# EAGLE design BlackIce-Nxt (EAGLE 7.5.0)
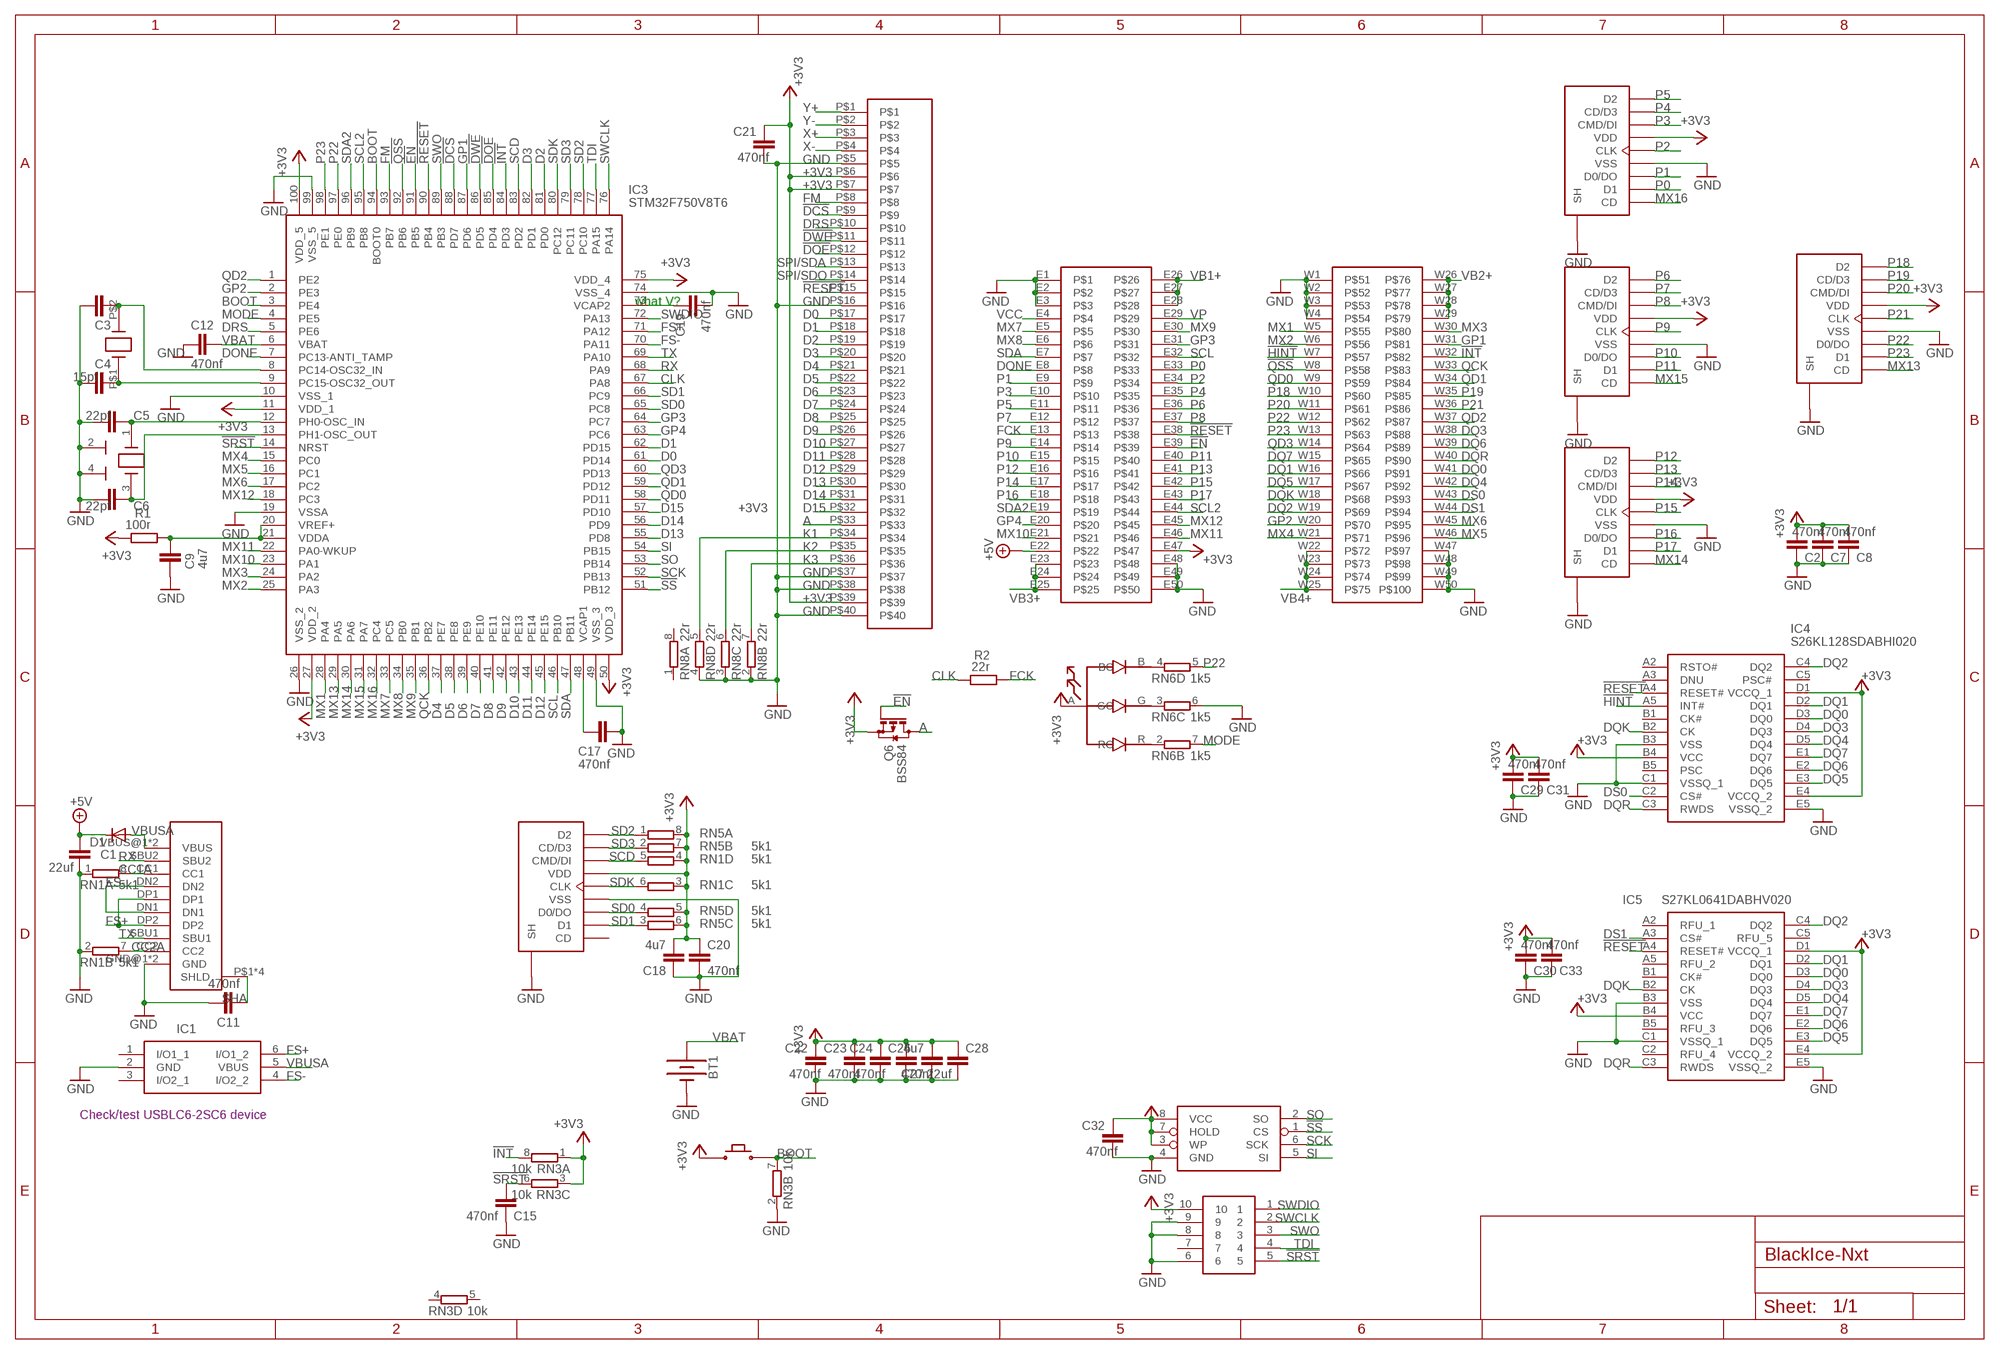
[diagram p0: schematic, sheet 1]

## Parts
B2  4X3-RA-BUTTON  [4X3-RA-BUTTON]
BT1  BATTERY-20MM_SMD  [BATTCON_20MM]
C1  22uf  C-EUC0603  [C0603]
C2  470nf  C-EUC0402  [C0402]
C3  15pf  C-EUC0402  [C0402]
C4  15pf  C-EUC0402  [C0402]
C5  22pf  C-EUC0402  [C0402]
C6  22pf  C-EUC0402  [C0402]
C7  470nf  C-EUC0402  [C0402]
C8  470nf  C-EUC0402  [C0402]
C9  4u7  C-EUC0402  [C0402]
C10  USB-C-16  [USB-C]
C11  470nf  C-EUC0402  [C0402]
C12  470nf  C-EUC0402  [C0402]
C15  470nf  C-EUC0402  [C0402]
C16  TF-15X15  [SDCARD]
C17  470nf  C-EUC0402  [C0402]
C18  4u7  C-EUC0402  [C0402]
C19  470nf  C-EUC0402  [C0402]
C20  470nf  C-EUC0402  [C0402]
C21  470nf  C-EUC0402  [C0402]
C22  470nf  C-EUC0402  [C0402]
C23  470nf  C-EUC0402  [C0402]
C24  470nf  C-EUC0402  [C0402]
C25  XF2M-4015-1AFPC-0.5  [XF2M-4015-1A]
C26  470nf  C-EUC0402  [C0402]
C27  4u7  C-EUC0402  [C0402]
C28  22uf  C-EUC0603  [C0603]
C29  470nf  C-EUC0402  [C0402]
C30  470nf  C-EUC0402  [C0402]
C31  470nf  C-EUC0402  [C0402]
C32  470nf  C-EUC0402  [C0402]
C33  470nf  C-EUC0402  [C0402]
C34  2X5-HEADER  [1.27-2X5-HEADER]
C35  TF-15X15  [SDCARD]
C36  TF-15X15  [SDCARD]
C38  TF-15X15  [SDCARD]
C41  TF-15X15  [SDCARD]
D1  DIODE-SOD123  [SOD123]
IC1  USBLC6-2SC6  [SOT95P280X145-6N]
IC3  STM32F750V8T6  [QFP50P1600X1600X160-100N]
IC4  S26KL128SDABHI020  [BGA24C100P5X5_600X800X100]
IC5  S27KL0641DABHV020  [BGA24C100P5X5_600X800X100]
IC6  AT25SDF041A  [SOIC-8-NARROW]
L1  RGB_LED  [RGB_LED_IMM]
Q6  BSS84  [SOT23]
R1  100r  R-EU_R0402  [R0402]
R2  22r  R-EU_R0402  [R0402]
RN1  5k1  4R-NEXB38V  [EXB38V]
RN3  10k  4R-NEXB38V  [EXB38V]
RN5  5k1  4R-NEXB38V  [EXB38V]
RN6  1k5  4R-NEXB38V  [EXB38V]
RN8  22r  4R-NEXB38V  [EXB38V]
T1  MEZZANINEM-TILE  [MEZZANINNE-T]
X1  FC-135  [FC135]
X2  12MZ  7M-25  [CRYSTAL-3.2X2.5]

## Nets
!DCS: C25.P$9 IC3.88(PD7)
!DOE: C25.P$12 IC3.85(PD4)
!DWE: C25.P$11 IC3.86(PD5)
!EN: IC3.91(PB5) Q6.1(G) T1.E39
!HINT: IC4.A5(INT#) T1.W7
!INT: IC3.84(PD3) RN3.8 T1.W32
!QSS: IC3.92(PB6) T1.W8
!RESET: C25.P$15 IC3.90(PB4) IC4.A4(RESET#) IC5.A4(RESET#) T1.E38
!SRST: C15.2 C34.5 IC3.14(NRST) RN3.6
!SS: IC3.51(PB12) IC6.1(CS)
+3V3: B2.P$1 C2.2 C7.2 C8.2 C16.P$6(VDD) C18.2 C20.1 C21.1 C22.1 C23.1 C24.1 C25.P$6 C25.P$7 C25.P$39 C26.2 C27.2 C28.1 C29.2 C30.2 C31.2 C32.1 C33.2 C34.10 C35.P$6(VDD) C36.P$6(VDD) C38.P$6(VDD) C41.P$6(VDD) IC3.11(VDD_1) IC3.27(VDD_2) IC3.50(VDD_3) IC3.75(VDD_4) IC3.100(VDD_5) IC4.B4(VCC) IC4.D1(VCCQ_1) IC4.E4(VCCQ_2) IC5.B4(VCC) IC5.D1(VCCQ_1) IC5.E4(VCCQ_2) IC6.3(WP) IC6.7(HOLD) IC6.8(VCC) L1.A(ANODE) Q6.2(S) R1.2 RN1.3 RN1.4 RN3.1 RN3.3 RN5.5 RN5.6 RN5.7 RN5.8 T1.E47
+5V: C1.1 D1.C T1.E22
A: C25.P$33 Q6.3(D)
BOOT: B2.P$2 IC3.3(PE4) IC3.94(BOOT0) RN3.7
CC1A: C10.CC1 RN1.8
CC2A: C10.CC2 RN1.7
CLK: IC3.67(PA8) R2.2
D0: C25.P$17 IC3.61(PD14)
D1: C25.P$18 IC3.62(PD15)
D2: C25.P$19 IC3.81(PD0)
D3: C25.P$20 IC3.82(PD1)
D4: C25.P$21 IC3.37(PE7)
D5: C25.P$22 IC3.38(PE8)
D6: C25.P$23 IC3.39(PE9)
D7: C25.P$24 IC3.40(PE10)
D8: C25.P$25 IC3.41(PE11)
D9: C25.P$26 IC3.42(PE12)
D10: C25.P$27 IC3.43(PE13)
D11: C25.P$28 IC3.44(PE14)
D12: C25.P$29 IC3.45(PE15)
D13: C25.P$30 IC3.55(PD8)
D14: C25.P$31 IC3.56(PD9)
D15: C25.P$32 IC3.57(PD10)
DONE: IC3.7(PC13-ANTI_TAMP) T1.E8
DQ0: IC4.D3(DQ0) IC5.D3(DQ0) T1.W41
DQ1: IC4.D2(DQ1) IC5.D2(DQ1) T1.W16
DQ2: IC4.C4(DQ2) IC5.C4(DQ2) T1.W19
DQ3: IC4.D4(DQ3) IC5.D4(DQ3) T1.W38
DQ4: IC4.D5(DQ4) IC5.D5(DQ4) T1.W42
DQ5: IC4.E3(DQ5) IC5.E3(DQ5) T1.W17
DQ6: IC4.E2(DQ6) IC5.E2(DQ6) T1.W39
DQ7: IC4.E1(DQ7) IC5.E1(DQ7) T1.W15
DQK: IC4.B2(CK) IC5.B2(CK) T1.W18
DQR: IC4.C3(RWDS) IC5.C3(RWDS) T1.W40
DRS: C25.P$10 IC3.5(PE6)
DS0: IC4.C2(CS#) T1.W43
DS1: IC5.A3(CS#) T1.W44
FCK: R2.1 T1.E13
FM: C25.P$8 IC3.93(PB7)
FS+: C10.DP1 C10.DP2 IC1.6(I/O1_2) IC3.71(PA12)
FS-: C10.DN1 C10.DN2 IC1.4(I/O2_2) IC3.70(PA11)
GND: BT1.2(-) C1.2 C2.1 C3.1 C4.1 C5.1 C6.1 C7.1 C8.1 C9.2 C10.GND@1(GND) C10.GND@2(GND) C11.1 C12.2 C15.1 C16.P$4(VSS) C16.P$10(SH) C16.P$11(SH) C16.P$12(SH) C16.P$13(SH) C17.1 C18.1 C19.2 C20.2 C21.2 C22.2 C23.2 C24.2 C25.P$5 C25.P$16 C25.P$37 C25.P$38 C25.P$40 C26.1 C27.1 C28.2 C29.1 C30.1 C31.1 C32.2 C33.1 C34.6 C34.8 C34.9 C35.P$4(VSS) C35.P$10(SH) C35.P$11(SH) C35.P$12(SH) C35.P$13(SH) C36.P$4(VSS) C36.P$10(SH) C36.P$11(SH) C36.P$12(SH) C36.P$13(SH) C38.P$4(VSS) C38.P$10(SH) C38.P$11(SH) C38.P$12(SH) C38.P$13(SH) C41.P$4(VSS) C41.P$10(SH) C41.P$11(SH) C41.P$12(SH) C41.P$13(SH) IC1.2(GND) IC3.10(VSS_1) IC3.19(VSSA) IC3.26(VSS_2) IC3.49(VSS_3) IC3.74(VSS_4) IC3.99(VSS_5) IC4.B3(VSS) IC4.C1(VSSQ_1) IC4.E5(VSSQ_2) IC5.B3(VSS) IC5.C1(VSSQ_1) IC5.E5(VSSQ_2) IC6.4(GND) RN1.1 RN1.2 RN3.2 RN6.6 RN8.2 RN8.3 RN8.4 T1.E1 T1.E2 T1.E3 T1.E48 T1.E49 T1.E50 T1.W1 T1.W2 T1.W3 T1.W4 T1.W47 T1.W48 T1.W49 T1.W50 X2.2(GND) X2.4(GND)
GP1: IC3.87(PD6) T1.W31
GP2: IC3.2(PE3) T1.W20
GP3: IC3.64(PC7) T1.E31
GP4: IC3.63(PC6) T1.E20
K1: C25.P$34 RN8.5
K2: C25.P$35 RN8.6
K3: C25.P$36 RN8.7
MODE: IC3.4(PE5) RN6.7
MX1: IC3.28(PA4) T1.W5
MX2: IC3.25(PA3) T1.W6
MX3: IC3.24(PA2) T1.W30
MX4: IC3.15(PC0) T1.W21
MX5: IC3.16(PC1) T1.W46
MX6: IC3.17(PC2) T1.W45
MX7: IC3.33(PC5) T1.E5
MX8: IC3.34(PB0) T1.E6
MX9: IC3.35(PB1) T1.E30
MX10: IC3.23(PA1) T1.E21
MX11: IC3.22(PA0-WKUP) T1.E46
MX12: IC3.18(PC3) T1.E45
MX13: C41.P$1(CD) IC3.29(PA5)
MX14: C36.P$1(CD) IC3.30(PA6)
MX15: C38.P$1(CD) IC3.31(PA7)
MX16: C35.P$1(CD) IC3.32(PC4)
N$2: L1.G(GC) RN6.3
N$4: L1.R(RC) RN6.2
N$6: L1.B(BC) RN6.4
N$10: C6.2 IC3.13(PH1-OSC_OUT) X2.3(X2)
N$11: C5.2 IC3.12(PH0-OSC_IN) X2.1(X1)
N$12: C4.2 IC3.9(PC15-OSC32_OUT) X1.P$1(X1)
N$13: C3.2 IC3.8(PC14-OSC32_IN) X1.P$2(X2)
N$14: C19.1 IC3.73(VCAP2)
N$87: C17.2 IC3.48(VCAP1)
N$88: C9.1 IC3.20(VREF+) IC3.21(VDDA) R1.1
P0: C35.P$2(D1) T1.E33
P1: C35.P$3(D0/DO) T1.E9
P2: C35.P$5(CLK) T1.E34
P3: C35.P$7(CMD/DI) T1.E10
P4: C35.P$8(CD/D3) T1.E35
P5: C35.P$9(D2) T1.E11
P6: C38.P$9(D2) T1.E36
P7: C38.P$8(CD/D3) T1.E12
P8: C38.P$7(CMD/DI) T1.E37
P9: C38.P$5(CLK) T1.E14
P10: C38.P$3(D0/DO) T1.E15
P11: C38.P$2(D1) T1.E40
P12: C36.P$9(D2) T1.E16
P13: C36.P$8(CD/D3) T1.E41
P14: C36.P$7(CMD/DI) T1.E17
P15: C36.P$5(CLK) T1.E42
P16: C36.P$3(D0/DO) T1.E18
P17: C36.P$2(D1) T1.E43
P18: C41.P$9(D2) T1.W10
P19: C41.P$8(CD/D3) T1.W35
P20: C41.P$7(CMD/DI) T1.W11
P21: C41.P$5(CLK) T1.W36
P22: C41.P$3(D0/DO) IC3.97(PE0) RN6.5 T1.W12
P23: C41.P$2(D1) IC3.98(PE1) T1.W13
QCK: IC3.36(PB2) T1.W33
QD0: IC3.58(PD11) T1.W9
QD1: IC3.59(PD12) T1.W34
QD2: IC3.1(PE2) T1.W37
QD3: IC3.60(PD13) T1.W14
RX: C10.SBU2 IC3.68(PA9)
SCD: C16.P$7(CMD/DI) IC3.83(PD2) RN1.5
SCK: IC3.52(PB13) IC6.6(SCK)
SCL: IC3.46(PB10) T1.E32
SCL2: IC3.95(PB8) T1.E44
SD0: C16.P$3(D0/DO) IC3.65(PC8) RN5.4
SD1: C16.P$2(D1) IC3.66(PC9) RN5.3
SD2: C16.P$9(D2) IC3.78(PC10) RN5.1
SD3: C16.P$8(CD/D3) IC3.79(PC11) RN5.2
SDA: IC3.47(PB11) T1.E7
SDA2: IC3.96(PB9) T1.E19
SDK: C16.P$5(CLK) IC3.80(PC12) RN1.6
SHA: C10.P$1(SHLD) C10.P$2(SHLD) C10.P$3(SHLD) C10.P$4(SHLD) C11.2
SI: IC3.54(PB15) IC6.5(SI)
SO: IC3.53(PB14) IC6.2(SO)
SPI/SDA: C25.P$13
SPI/SDO: C25.P$14
SWCLK: C34.2 IC3.76(PA14)
SWDIO: C34.1 IC3.72(PA13)
SWO: C34.3 IC3.89(PB3)
TDI: C34.4 IC3.77(PA15)
TX: C10.SBU1 IC3.69(PA10)
VB1+: T1.E26 T1.E27 T1.E28
VB2+: T1.W26 T1.W27 T1.W28 T1.W29
VB3+: T1.E23 T1.E24 T1.E25
VB4+: T1.W22 T1.W23 T1.W24 T1.W25
VBAT: BT1.1(+) C12.1 IC3.6(VBAT)
VBUSA: C10.VBUS@1(VBUS) C10.VBUS@2(VBUS) D1.A IC1.5(VBUS)
VCC: T1.E4
VP: T1.E29
X+: C25.P$3
X-: C25.P$4
Y+: C25.P$1
Y-: C25.P$2
Unconnected: C16.P$1(CD) C25.P$41 C25.P$42 C34.7 IC1.1(I/O1_1) IC1.3(I/O2_1) IC4.A2(RSTO#) IC4.A3(DNU) IC4.B1(CK#) IC4.B5(PSC) IC4.C5(PSC#) IC5.A2(RFU_1) IC5.A5(RFU_2) IC5.B1(CK#) IC5.B5(RFU_3) IC5.C2(RFU_4) IC5.C5(RFU_5) RN3.4 RN3.5 RN6.1 RN6.8 RN8.1 RN8.8

## Notes on the sheet
- what V?
- Check/test USBLC6-2SC6 device

## Library data of the parts
B2 = amino:4X3-RA-BUTTON
BT1 = SparkFun-Batteries:BATTERY: Battery - Single Cell A variety of battery chemistries, sizes, and footprints. Device List: 20MM_PTH - Coin Cell Battery Holder - 20mm (PTH) <https://www.sparkfun.com/products/783> 20MM_PTH_KIT- Coin Cell battery Holder - 20 mm (PTH) <http://www.sparkfun.com/products/783>kit version with special mask 6.8MM_PTH - Coin Cell Battery Holder - 6.8MM(SMD) <https://www.digikey.com/product-detail/en/seiko-instruments/MS621FE-FL11E/728-1057-ND/1889208?WT.srch=1&gclid=CNOQ5a6LzdQCFZS2wAodXCkE0g> 12MM_SMD - Coin Cell Battery Holder - 12mm (SMD) <https://www.sparkfun.com/products/10592> 12MM_PTH - Coin Cell Battery Holder - 12mm (PTH) <https://www.sparkfun.com/products/7948> 20MM_SMD - 20mm Coin Cell Battery Holder (SMD) (2 legs) Used on the Big Time Watch Kit <https://www.sparkfun.com/products/11734> 20MM_SMD_4LEGS - Coin Cell Battery Holder - 20mm (SMD) <https://www.sparkfun.com/products/11892> 20MM_SMD_4LEGS_OVERPASTE - Coin Cell Battery Holder - 20mm (SMD) <https://www.sparkfun.com/products/11892> (Over-paste on the legs) 24.5MM_PTH - Coin Cell Battery Holder - 24.5mm (PTH) <https://www.sparkfun.com/products/8863> 9V - 9V Battery Holder - PC Mount Used on the SparkFun SparkPunk Sound Kit <https://www.sparkfun.com/products/11177> and SparkFun SparkPunk Sequencer Kit <https://www.sparkfun.com/products/12707> 18650 - Battery Holder - 18650 (PTH) <https://www.sparkfun.com/products/13113> AA - Battery Holder - 1xAA (PTH) <https://www.sparkfun.com/products/7949> AAA - Battery Holder - 1xAAA (PTH) <https://www.sparkfun.com/products/12718> AA_KIT - Battery Holder - 1xAA (PTH) <https://www.sparkfun.com/products/7949> Special kit package - pads only have exposed copper on one side of the board. AAA_KIT - Battery Holder - 1xAAA (PTH) <https://www.sparkfun.com/products/12718> Special kit package - pads only have exposed copper on one side of the board.; PROD_ID: BATT-11519
C1-C9 C11 C12 C15 C17-C24 C26-C33 = rcl:C-EU: CAPACITOR, European symbol
C10 = amino:USB-C-16
C16 C35 C36 C38 C41 = amino:TF-15X15
C25 = amino:XF2M-4015-1A
C34 = amino:2X5-HEADER
D1 = diode:DIODE-: DIODE
IC1 = SamacSys_Parts:USBLC6-2SC6: TVS Diode Array Uni-Directional USBLC6-2SC6 17V, SOT-23 6-Pin Source: Datasheet <http://www.st.com/st-web-ui/static/active/en/resource/technical/document/datasheet/CD00050750.pdf>; DESCRIPTION: TVS Diode Array Uni-Directional USBLC6-2SC6 17V, SOT-23 6-Pin; HEIGHT: 1.45mm; MANUFACTURER_NAME: STMicroelectronics; MANUFACTURER_PART_NUMBER: USBLC6-2SC6; MOUSER_PART_NUMBER: 511-USBLC6-2SC6; MOUSER_PRICE-STOCK: https://www.mouser.co.uk/ProductDetail/STMicroelectronics/USBLC6-2SC6?qs=po45yt2pPpu%2FhNIlwQdTlg%3D%3D
IC3 = SamacSys_Parts:STM32F750V8T6: STMICROELECTRONICS - STM32F750V8T6 - MCU, 32BIT, 216MHZ, LQFP-100 Source: Datasheet <https://www.st.com/resource/en/datasheet/stm32f750v8.pdf>; DESCRIPTION: STMICROELECTRONICS - STM32F750V8T6 - MCU, 32BIT, 216MHZ, LQFP-100; HEIGHT: 1.6mm; MANUFACTURER_NAME: STMicroelectronics; MANUFACTURER_PART_NUMBER: STM32F750V8T6; MOUSER_PART_NUMBER: 511-STM32F750V8T6; MOUSER_PRICE-STOCK: https://www.mouser.co.uk/ProductDetail/STMicroelectronics/STM32F750V8T6?qs=%252BEew9%252B0nqrBG59alEpQKbw%3D%3D
IC4 = SamacSys_Parts:S26KL128SDABHI020: NOR Flash Nor Source: Datasheet <https://www.cypress.com/file/213346/download>; DESCRIPTION: NOR Flash Nor; HEIGHT: 1mm; MANUFACTURER_NAME: Cypress Semiconductor; MANUFACTURER_PART_NUMBER: S26KL128SDABHI020; MOUSER_PART_NUMBER: 727-S26KL128SDABHI02; MOUSER_PRICE-STOCK: https://www.mouser.co.uk/ProductDetail/Cypress-Semiconductor/S26KL128SDABHI020?qs=oeTp6q%252Bm7GMEHKDcBIxfzA%3D%3D
IC5 = SamacSys_Parts:S27KL0641DABHV020: CYPRESS SEMICONDUCTOR - S27KL0641DABHV020 - DRAM, 64MBIT, 36NS, FBGA-24 Source: Datasheet <https://www.cypress.com/file/183506/download>; DESCRIPTION: CYPRESS SEMICONDUCTOR - S27KL0641DABHV020 - DRAM, 64MBIT, 36NS, FBGA-24; HEIGHT: 1mm; MANUFACTURER_NAME: Cypress Semiconductor; MANUFACTURER_PART_NUMBER: S27KL0641DABHV020; MOUSER_PART_NUMBER: 727-S27KL0641DABHV02; MOUSER_PRICE-STOCK: https://www.mouser.co.uk/ProductDetail/Cypress-Semiconductor/S27KL0641DABHV020?qs=74EMXstkWMU1y2SuN5BsMA%3D%3D
IC6 = amino:AT25SDF041A
L1 = amino:RGB_LED
Q6 = transistor-small-signal:BSS84: P-CHANNEL MOS FET
R1 R2 = resistor:R-EU_: RESISTOR, European symbol
RN1 RN3 RN5 RN6 RN8 = resistor-dil:4R-N: Array Chip Resistor Source: RS Component / Phycomp; OC_FARNELL: unknown; OC_NEWARK: unknown
T1 = amino:MEZZANINE
X1 = amino:FC-135
X2 = amino:7M-25

## Board
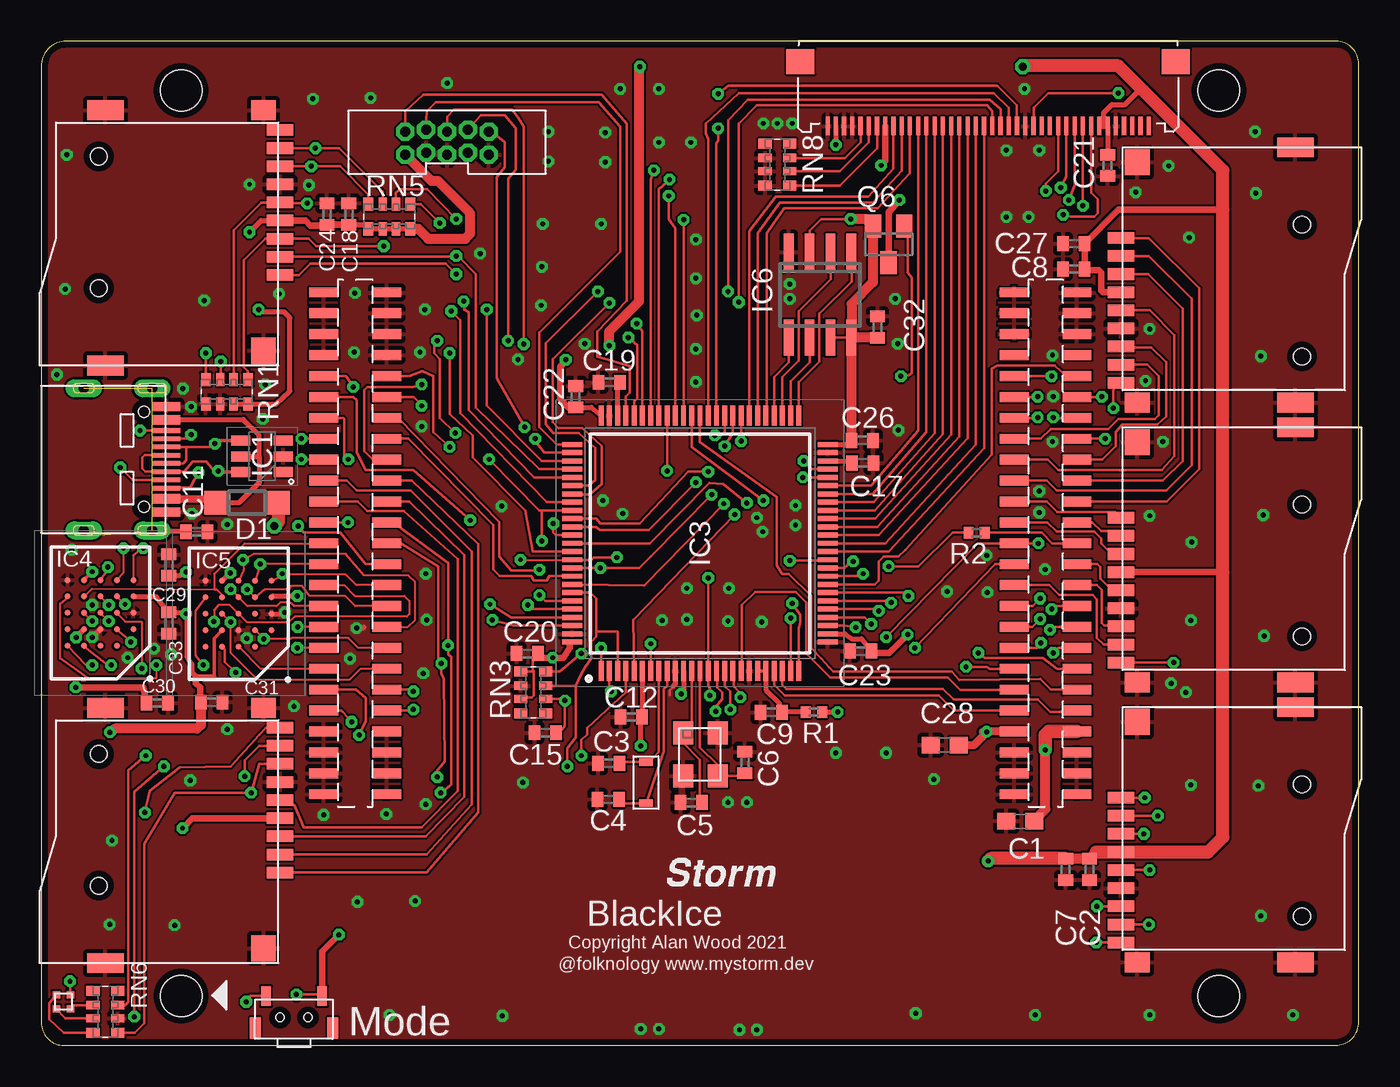
[diagram p1: board, top side]
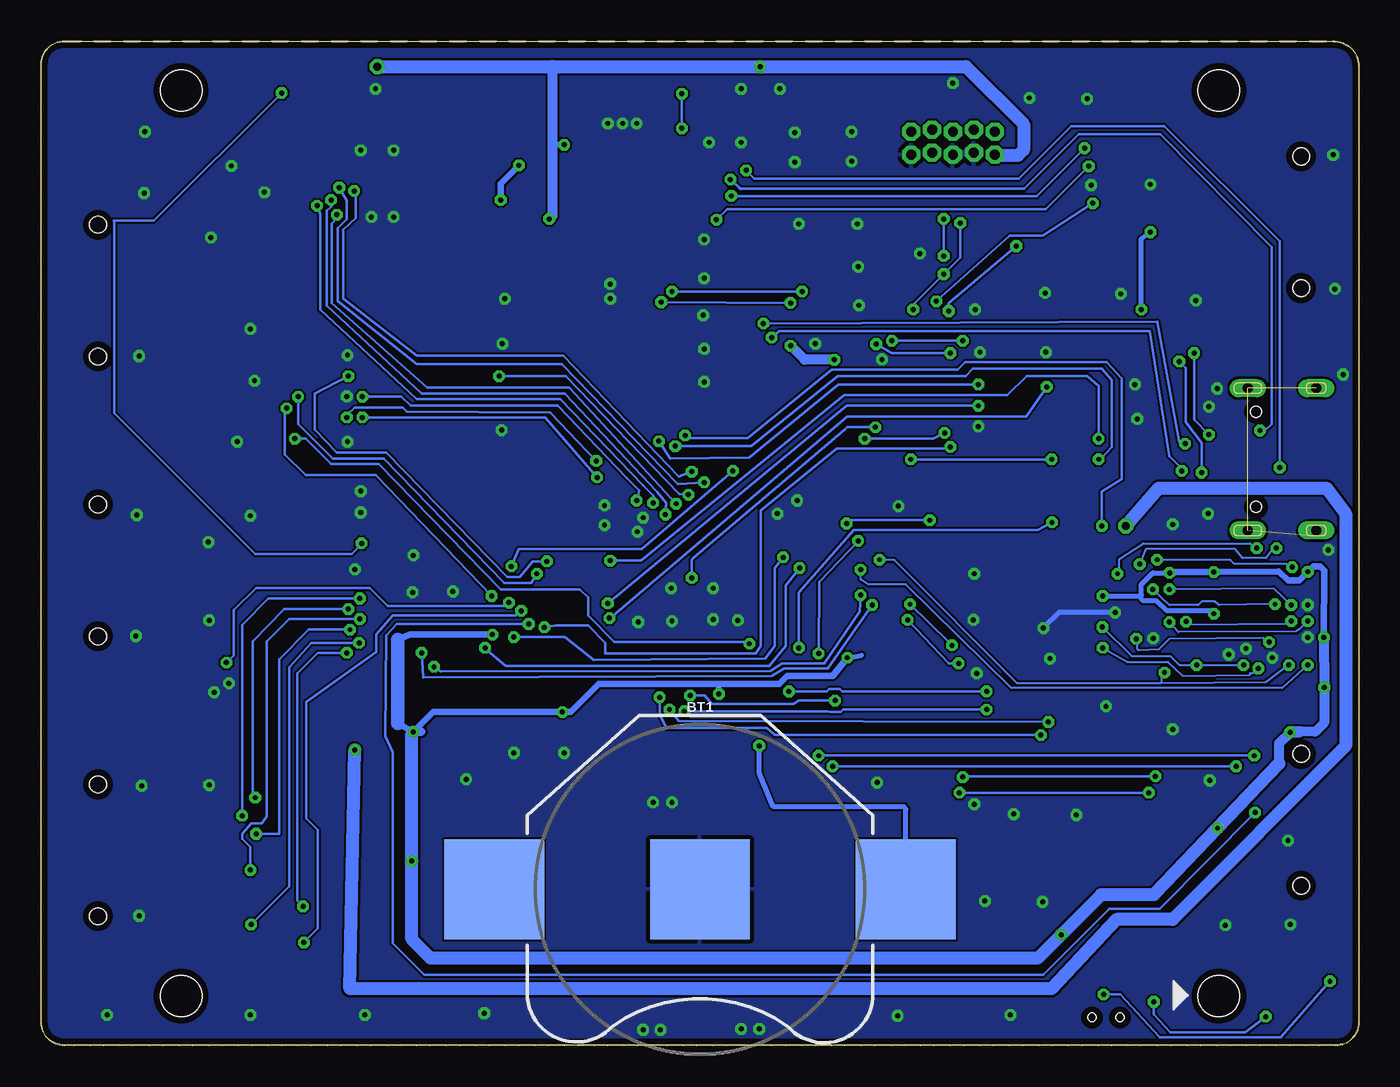
[diagram p2: board, bottom side, seen from below]

Size 80 x 61 mm. Coordinates in mm from the lower left corner, seen from the top.
Outline: 78.62,61 1.52,61 arc90 0,59.48 0,1.38 arc90 1.38,0 78.59,0 arc90 80,1.41 80,59.62 arc90 78.62,61
Copper layers (1*16): Top 0.035mm / dielectric 1.5mm / Bottom 0.035mm
Design rules "JLC-2-layer *": minimum track width 5mil, minimum drill 0.3mm, track to track 5mil, track to pad 5mil, pad to pad 5mil, via to via 6mil, smd to smd 5mil, copper to edge 0.4mm, drill to drill 0.5mm, minimum pad ring 10mil, minimum via ring 8mil, stop-mask expansion 4mil, vias tented up to drill 0.3mm, thermal gap 10mil

### Footprints (pad centres in the part's own frame; a part is rotated, then mirrored left to right if it is on the bottom)
4X3-RA-BUTTON = smd 0.6 x 1.2: P$1 -1.7,-2.6; P$2 1.7,-2.6 | smd 0.65 x 1.3: SH1 -2.35,-0.65; SH2 2.35,-0.65 | hole 0.5: -0.85,-1.3; 0.85,-1.3
BATTCON_20MM = smd 6.07 x 6.07: 1 -12.5,0; 2 0,0; 3 12.5,0
C0603 = smd 1.1 x 1: 1 -0.85,0; 2 0.85,0
C0402 = smd 0.7 x 0.9: 1 -0.65,0; 2 0.65,0
USB-C = smd 0.28 x 1.7: CC1 -1.25,5; CC2 1.75,5; DN1 0.25,5; DN2 -0.75,5; DP1 -0.25,5; DP2 0.75,5; SBU1 1.25,5; SBU2 -1.75,5 | smd 0.56 x 1.7: GND@1 -3.2,5; GND@2 3.2,5; VBUS@1 -2.4,5; VBUS@2 2.4,5 | drill 0.6 long: P$1 -4.32,4.15; P$2 4.32,4.15; P$3 -4.32,0; P$4 4.32,0 | hole 0.65: -2.89,3.65; 2.89,3.65
SDCARD = smd 0.7 x 1.6: P$1 -5.5,1.1; P$2 -4.4,1.1; P$3 -3.3,1.1; P$4 -2.2,1.1; P$5 -1.1,1.1; P$6 0,1.1; P$7 1.1,1.1; P$8 2.2,1.1; P$9 3.3,1.1 | smd 1.2 x 1.5: P$10 -6.7,0.1 | smd 1.6 x 1.5: P$11 7.9,0.1 | smd 1.2 x 2.2: P$12 -6.7,-9.5; P$13 8.8,-9.5 | hole 1: -3.9,-9.9; 4.1,-9.9
XF2M-4015-1A = smd 0.25 x 1.1: P$1 -9.75,0.9; P$2 -9.25,0.9; P$3 -8.75,0.9; P$4 -8.25,0.9; P$5 -7.75,0.9; P$6 -7.25,0.9; P$7 -6.75,0.9; P$8 -6.25,0.9; P$9 -5.75,0.9; P$10 -5.25,0.9; P$11 -4.75,0.9; P$12 -4.25,0.9; P$13 -3.75,0.9; P$14 -3.25,0.9; P$15 -2.75,0.9; P$16 -2.25,0.9; P$17 -1.75,0.9; P$18 -1.25,0.9; P$19 -0.75,0.9; P$20 -0.25,0.9; P$21 0.25,0.9; P$22 0.75,0.9; P$23 1.25,0.9; P$24 1.75,0.9; P$25 2.25,0.9; P$26 2.75,0.9; P$27 3.25,0.9; P$28 3.75,0.9; P$29 4.25,0.9; P$30 4.75,0.9; P$31 5.25,0.9; P$32 5.75,0.9; P$33 6.25,0.9; P$34 6.75,0.9; P$35 7.25,0.9; P$36 7.75,0.9; P$37 8.25,0.9; P$38 8.75,0.9; P$39 9.25,0.9; P$40 9.75,0.9 | smd 1.7 x 1.5: P$41 11.4,-3; P$42 -11.4,-3
1.27-2X5-HEADER = drill 0.6 pad 1.016 octagon: 1 -2.54,0; 2 -1.27,-0.127; 3 0,0; 4 1.27,-0.127; 5 2.54,0; 6 2.54,1.397; 7 1.27,1.27; 8 0,1.397; 9 -1.27,1.27; 10 -2.54,1.397
SOD123 = smd 1.4 x 1.4: A 1.9,0; C -1.9,0
SOT95P280X145-6N = smd 1.15 x 0.6: 1 -1.3,0.95; 2 -1.3,0; 3 -1.3,-0.95; 4 1.3,-0.95; 5 1.3,0; 6 1.3,0.95
QFP50P1600X1600X160-100N = smd 1.2 x 0.3: 1 -7.75,6; 2 -7.75,5.5; 3 -7.75,5; 4 -7.75,4.5; 5 -7.75,4; 6 -7.75,3.5; 7 -7.75,3; 8 -7.75,2.5; 9 -7.75,2; 10 -7.75,1.5; 11 -7.75,1; 12 -7.75,0.5; 13 -7.75,0; 14 -7.75,-0.5; 15 -7.75,-1; 16 -7.75,-1.5; 17 -7.75,-2; 18 -7.75,-2.5; 19 -7.75,-3; 20 -7.75,-3.5; 21 -7.75,-4; 22 -7.75,-4.5; 23 -7.75,-5; 24 -7.75,-5.5; 25 -7.75,-6; 51 7.75,-6; 52 7.75,-5.5; 53 7.75,-5; 54 7.75,-4.5; 55 7.75,-4; 56 7.75,-3.5; 57 7.75,-3; 58 7.75,-2.5; 59 7.75,-2; 60 7.75,-1.5; 61 7.75,-1; 62 7.75,-0.5; 63 7.75,0; 64 7.75,0.5; 65 7.75,1; 66 7.75,1.5; 67 7.75,2; 68 7.75,2.5; 69 7.75,3; 70 7.75,3.5; 71 7.75,4; 72 7.75,4.5; 73 7.75,5; 74 7.75,5.5; 75 7.75,6 | smd 0.3 x 1.2: 26 -6,-7.75; 27 -5.5,-7.75; 28 -5,-7.75; 29 -4.5,-7.75; 30 -4,-7.75; 31 -3.5,-7.75; 32 -3,-7.75; 33 -2.5,-7.75; 34 -2,-7.75; 35 -1.5,-7.75; 36 -1,-7.75; 37 -0.5,-7.75; 38 0,-7.75; 39 0.5,-7.75; 40 1,-7.75; 41 1.5,-7.75; 42 2,-7.75; 43 2.5,-7.75; 44 3,-7.75; 45 3.5,-7.75; 46 4,-7.75; 47 4.5,-7.75; 48 5,-7.75; 49 5.5,-7.75; 50 6,-7.75; 76 6,7.75; 77 5.5,7.75; 78 5,7.75; 79 4.5,7.75; 80 4,7.75; 81 3.5,7.75; 82 3,7.75; 83 2.5,7.75; 84 2,7.75; 85 1.5,7.75; 86 1,7.75; 87 0.5,7.75; 88 0,7.75; 89 -0.5,7.75; 90 -1,7.75; 91 -1.5,7.75; 92 -2,7.75; 93 -2.5,7.75; 94 -3,7.75; 95 -3.5,7.75; 96 -4,7.75; 97 -4.5,7.75; 98 -5,7.75; 99 -5.5,7.75; 100 -6,7.75
BGA24C100P5X5_600X800X100 = smd 0.37 x 0.37: A2 -1,2; A3 0,2; A4 1,2; A5 2,2; B1 -2,1; B2 -1,1; B3 0,1; B4 1,1; B5 2,1; C1 -2,0; C2 -1,0; C3 0,0; C4 1,0; C5 2,0; D1 -2,-1; D2 -1,-1; D3 0,-1; D4 1,-1; D5 2,-1; E1 -2,-2; E2 -1,-2; E3 0,-2; E4 1,-2; E5 2,-2
SOIC-8-NARROW = smd 0.6 x 2.2: 1 -1.905,-2.6; 2 -0.635,-2.6; 3 0.635,-2.6; 4 1.905,-2.6; 5 1.905,2.6; 6 0.635,2.6; 7 -0.635,2.6; 8 -1.905,2.6
RGB_LED_IMM = smd 0.45 x 0.45: A 0.425,0.425; B -0.425,0.425; G -0.425,-0.425; R 0.425,-0.425
SOT23 = smd 1 x 1.4: 1 -0.95,-1.1; 2 0.95,-1.1; 3 0,1.1
R0402 = smd 0.6 x 0.7: 1 -0.5,0; 2 0.5,0
EXB38V = smd 0.6 x 0.8: 1 -1.275,-0.75; 4 1.275,-0.75; 5 1.275,0.75; 8 -1.275,0.75 | smd 0.5 x 0.8: 2 -0.4,-0.75; 3 0.4,-0.75; 6 0.4,0.75; 7 -0.4,0.75
MEZZANINNE-T = smd 1.75 x 0.6 bottom: E1 -22.885,15.24; E2 -22.885,13.97; E3 -22.885,12.7; E4 -22.885,11.43; E5 -22.885,10.16; E6 -22.885,8.89; E7 -22.885,7.62; E8 -22.885,6.35; E9 -22.885,5.08; E10 -22.885,3.81; E11 -22.885,2.54; E12 -22.885,1.27; E13 -22.885,0; E14 -22.885,-1.27; E15 -22.885,-2.54; E16 -22.885,-3.81; E17 -22.885,-5.08; E18 -22.885,-6.35; E19 -22.885,-7.62; E20 -22.885,-8.89; E21 -22.885,-10.16; E22 -22.885,-11.43; E23 -22.885,-12.7; E24 -22.885,-13.97; E25 -22.885,-15.24; E26 -19.075,15.24; E27 -19.075,13.97; E28 -19.075,12.7; E29 -19.075,11.43; E30 -19.075,10.16; E31 -19.075,8.89; E32 -19.075,7.62; E33 -19.075,6.35; E34 -19.075,5.08; E35 -19.075,3.81; E36 -19.075,2.54; E37 -19.075,1.27; E38 -19.075,0; E39 -19.075,-1.27; E40 -19.075,-2.54; E41 -19.075,-3.81; E42 -19.075,-5.08; E43 -19.075,-6.35; E44 -19.075,-7.62; E45 -19.075,-8.89; E46 -19.075,-10.16; E47 -19.075,-11.43; E48 -19.075,-12.7; E49 -19.075,-13.97; E50 -19.075,-15.24; W1 19.025,15.24; W2 19.025,13.97; W3 19.025,12.7; W4 19.025,11.43; W5 19.025,10.16; W6 19.025,8.89; W7 19.025,7.62; W8 19.025,6.35; W9 19.025,5.08; W10 19.025,3.81; W11 19.025,2.54; W12 19.025,1.27; W13 19.025,0; W14 19.025,-1.27; W15 19.025,-2.54; W16 19.025,-3.81; W17 19.025,-5.08; W18 19.025,-6.35; W19 19.025,-7.62; W20 19.025,-8.89; W21 19.025,-10.16; W22 19.025,-11.43; W23 19.025,-12.7; W24 19.025,-13.97; W25 19.025,-15.24; W26 22.835,15.24; W27 22.835,13.97; W28 22.835,12.7; W29 22.835,11.43; W30 22.835,10.16; W31 22.835,8.89; W32 22.835,7.62; W33 22.835,6.35; W34 22.835,5.08; W35 22.835,3.81; W36 22.835,2.54; W37 22.835,1.27; W38 22.835,0; W39 22.835,-1.27; W40 22.835,-2.54; W41 22.835,-3.81; W42 22.835,-5.08; W43 22.835,-6.35; W44 22.835,-7.62; W45 22.835,-8.89; W46 22.835,-10.16; W47 22.835,-11.43; W48 22.835,-12.7; W49 22.835,-13.97; W50 22.835,-15.24 | hole 2.5: -31.5,-27.5; 31.5,-27.5; -31.5,27.5; 31.5,27.5
FC135 = smd 0.45 x 0.8: P$1 -1.25,0; P$2 1.25,0
CRYSTAL-3.2X2.5 = smd 1.4 x 1.2: 1 -1.3,-1; 2 1.3,-1; 3 1.3,1.1; 4 -1.3,1.1

### Placement (x,y rotation side)
B2  15.35,0.4 180 top
BT1  40,9.48 180 bottom
C1  59.44,13.62 180 top
C2  63.65,10.7 90 top
C3  34.47,17.13 0 top
C4  34.42,14.95 0 top
C5  39.48,14.76 0 top
C6  42.73,17.18 270 top
C7  62.2,10.7 90 top
C8  62.7,47.15 0 top
C9  44.34,20.23 180 top
C10  2.59,35.6 270 top
C11  9.45,31.2 180 top
C12  35.83,19.95 180 top
C15  30.61,18.99 0 top
C16  13.4,50.1 270 top
C17  49.88,35.38 180 top
C18  18.68,50.5 270 top
C19  34.48,40.27 180 top
C20  29.52,23.8 180 top
C21  64.75,53.45 270 top
C22  32.45,39.4 90 top
C23  49.75,23.95 180 top
C24  17.35,50.5 90 top
C25  57.5,56.75 180 top
C26  49.85,36.75 180 top
C27  62.7,48.7 0 top
C28  54.85,18.25 180 top
C29  7.75,29.18 270 top
C30  7.05,20.8 180 top
C31  10.35,20.85 180 top
C32  50.78,43.64 90 top
C33  7.75,25.65 90 top
C34  24.64,55.5 180 bottom
C35  66.65,45.75 90 top
C36  66.65,11.75 90 top
C38  66.65,28.75 90 top
C41  13.4,13.8 270 top
D1  12.5,32.96 180 top
IC1  13.41,35.78 180 top
IC3  40,30.5 90 top
IC4  3.6,26.27 180 top
IC5  11.99,26.22 180 top
IC6  47.28,45.6 180 top
L1  1.35,2.65 0 top
Q6  51.45,48.65 180 top
R1  46.91,20.26 0 top
R2  56.8,31.15 180 top
RN1  11.28,39.7 0 top
RN3  29.88,21.45 270 top
RN5  21.14,50.35 180 top
RN6  3.9,2.05 270 top
RN8  44.7,53.5 270 top
T1  40,30.5 0 bottom
X1  36.73,15.97 90 top
X2  39.98,17.68 270 top

### Tracks (layer width: path | path; a pad name or v marks a point on that pad's centre or on a via)
!DCS  (via drill 0.3)
  Top 0.15: IC3.88 36.95,30.5 40.55,34.15 41.4,34.1 v42.85,32.95 | v63.25,51 63.25,55.75 C25.P$9
  Bottom 0.15: v42.85,32.95 42.85,33.4 43.45,34 48.5,39.25 57.2,39.25 63.05,44.7 63.05,50.5 v63.25,51
!DOE  (via drill 0.3)
  Top 0.15: IC3.85 33.7,32 33.95,31.7 36.35,31.7 39.3,34.85 v40.5,34.85 | v61,51.9 61,52.35 61.75,53.1 C25.P$12
  Bottom 0.15: v40.5,34.85 41.3,34.55 48.3,41.9 57.2,41.9 61.65,45.35 61.65,49.55 60.9,50.25 60.9,51.6 v61,51.9
!DWE  (via drill 0.3)
  Top 0.15: IC3.86 33.7,31.5 33.9,31.3 36.9,31.3 v39.75,34.2 | v61.9,52.1 62.25,52.8 C25.P$11
  Bottom 0.15: v39.75,34.2 41.35,34.1 48.4,41.4 57.2,41.4 62,45.2 62,49.65 61.45,50.2 61.45,51.3 v61.9,52.1
!EN  (via drill 0.3)
  Top 0.15: T1.E39 57.93,29.23 v53.05,24.15 | IC3.91 v33.95,29 36.3,29 37,29.7 v40.7,33.45 | v52.2,40.65 52.65,40.7 52.85,40.85 52.85,46.65 52.6,46.95 52.6,49.55 Q6.1
  Bottom 0.15: v53.05,24.15 53.1,24.15 51.8,23.05 35.8,23.05 34.8,24.25 34.8,27.95 v33.95,29 | v40.7,33.45 41.25,33.5 48.15,40.65 v52.2,40.65
!HINT  (via drill 0.3)
  Top 0.127: IC4.A5 2.72,23.1 v3.1,23.1
  Top 0.15: T1.W7 21.68,38.12 27.8,31.8 27.8,29.7 28.55,28.85 30.2,28.85 v30.25,28.9
  Bottom 0.127: v3.1,23.1 4.65,21.7 21.1,21.7 27.5,28 29.8,28 30.25,28.3 v30.25,28.9
!INT  (via drill 0.3)
  Top 0.15: T1.W32 18.33,38.12 18.4,38.05 18.4,35.8 v18.65,35.6 | v27.2,35.6 30.25,32.5 30.4,32.5 | 30.4,32.5 IC3.84 | RN3.8 31.47,22.72 v32.8,23.8 | v30.4,30.65 30.4,32.5
  Bottom 0.15: v18.65,35.6 v27.2,35.6 | v32.8,23.8 32.75,28.15 v30.4,30.65
!QSS
  Top 0.15: T1.W8 22.3,36.85 27.45,31.6 27.45,28.9 27.85,28.5 29.75,28.5 29.9,28.25 30.7,28.25 30.85,28.5 IC3.92
!RESET  (via drill 0.3)
  Top 0.127: IC4.A4 4.05,23.12 v4.25,23.1 | v29.1,29.5 IC3.90
  Top 0.15: v51.3,24.8 56.85,30.5 T1.E38 v60.55,30.5 | v34.95,29.65 33.55,29.65 33.4,29.5 IC3.90 | 60.25,55.75 C25.P$15 60.25,55.75 60.25,56.95 61.15,57.85 v65.4,57.85 | IC5.A4 11.15,24.06 11.15,23.3 v11.8,22.65
  Bottom 0.127: v4.25,23.1 5.65,22.05 12,22 | 12,22 20.75,22 28.2,29.5 v29.1,29.5 | 12,22.4 12,22
  Bottom 0.15: v51.3,24.8 48.2,24.8 46.45,23.4 36.05,23.5 35.45,24.25 35.45,29 v34.95,29.65 | v60.55,30.5 61.15,29.85 67,29.85 75.55,38.4 75.55,50.05 75.6,50.1 73.15,50.1 v65.4,57.85 | v11.8,22.65 12,22.4
!SRST  (via drill 0.3)
  Top 0.15: v40.6,21.25 40.6,21.7 40.5,21.85 IC3.14 v40.5,28.4 | RN3.6 31.6,21.05 v31.8,20.95 31.8,19.4 31.65,19.2 C15.2 | C34.5 27.35,55.5 28.15,54.85 28.15,53.35 27.65,52.75 27.65,40.55 v29.35,37.55
  Bottom 0.15: v40.6,21.25 40.35,21.2 40.3,21.25 39.7,21.25 39.3,20.75 34.3,20.75 34,20.95 v31.8,20.95 | v29.35,37.55 31.05,37.55 31.2,37.4 40.4,29.6 40.5,29.5 v40.5,28.4
!SS
  Top 0.15: IC3.51 46,40.3 47.25,41.55 47.25,44.45 49.2,46.4 IC6.1
+3V3  (via drill 0.3, 0.5)
  Top 0.15: RN3.1 29.83,22.72 | 29.83,22.72 29.9,22.75 29.9,21.25 29.8,21.15 29.13,21.15 RN3.3 | 29.83,22.72 29.85,22.74 29.85,23.48 C20.1 | IC6.7 IC6.8 | IC6.3 46.65,49.5 47.35,50.2 v49.15,50.2 | L1.A 1.78,3.77 v1.75,3.9 | v15.5,3.1 16.85,3.1 B2.P$1
  Top 0.2: IC5.B4 10.5,24.73 10.5,22.4 | IC4.E4 v3.1,28.77 | IC4.D1 5.62,27.25
  Top 0.3: R1.2 48.05,20.26 v48.35,20.25 | C22.1 33.4,38.75 IC3.75 | C25.P$7 C25.P$6 | IC3.50 49,36.5 C26.2 | IC3.27 48.8,25 49.2,24.7 49.8,24.7 C23.1 50.4,23.85 | IC5.E4 10.99,28.24 v11.49,28.7 | C29.2 8.45,28.55 8.65,28.75 v8.8,28.75 | C33.2 7,27.25 5.62,27.25
  Top 0.305: 10.5,22.4 9.4,22.4 9.15,22.65 9.15,23.15 8.85,23.6 8.85,25.92 v8.8,26.22 8.62,26.3 C33.2 | IC5.D1 14.07,27.3 v15.55,27.3 | 32.1,24.35 IC3.100 | 3.15,28.82 v3.1,28.77 | IC4.B4 2.13,24.8 v2.12,24.78 | IC3.11 39,21.5 v38.85,21.35 | C18.2 19.61,49.85 RN5.5 RN5.6 RN5.7 RN5.8 | C25.P$39 v48.24,54.7 v48.25,54.7 | 66.9,58 66.65,58 65.8,57.15 65,57.15 64.5,56.65 64.5,56.09 C25.P$6 C21.1 | v13.2,44.7 13.2,44.55 14.75,44.55 15.1,44.2 15.1,39.75 14.25,38.95 RN1.4 RN1.3 | v12.65,49.4 13.35,50.1 C16.P$6
  Top 0.406: C20.1 30.42,23.55 v31.05,23.55 31.7,23.55 32.1,24.15 32.1,24.35 | 50.4,23.85 51.5,23.85 v52.6,24.95 | v31.85,41.65 31.5,41.2 31.5,39.25 32,38.75 C22.1 | C35.P$6 64.45,45.75 64.35,45.85 64.35,46.95 64.2,47.1 63.4,47.1 C8.2 C27.2 65.4,50.75 71.75,50.75 | C30.2 6.2,21.75 v2.1,21.75 | 9.4,22.4 9.4,22 9.65,21.75 9.65,20.85 | C41.P$6 9.18,13.8 v8.58,13.2 | B2.P$1 17.05,5.7 v18.07,6.73 | C16.P$6 16.05,50.1 16.35,49.8 17.3,49.8 C24.1 C18.2 | C38.P$6 71.75,28.75
  Top 0.5: T1.E47 57.17,19.07 v57.4,19.05 57.45,19.05 56.65,18.25 C28.1
  Top 0.61: C32.1 IC6.8 | C26.2 IC6.8 | IC6.8 49.2,45.05 50.5,46.35 Q6.2 50.05,50.2 v49.15,50.2 | C7.2 C2.2 64.05,11.75 | C31.2 9.7,19.45 9.45,19.25 4.5,19.25 v4.18,19.02 | RN5.8 22.9,49.6 23.5,49 25.75,49 26.05,49.3 26.05,50.55 24.1,52.5 23.7,52.5 C34.10 | v34.5,42.5 34.5,43.4 36.3,45.2 36.3,59.4 v36.35,59.45
  Top 0.8: C7.2 57.65,11.35 v57.5,11.2 | v59.6,59.45 59.65,59.5 65.4,59.5 66.9,58 71.75,53.15 71.75,50.75 71.75,28.75 71.75,12.65 70.85,11.75 C36.P$6 64.05,11.75
  Bottom 0.15: v1.75,3.9 4.75,0.5 12.1,0.5 14.5,3.1 v15.5,3.1
  Bottom 0.3: v48.35,20.25 48.45,20.25 | v31.05,23.55 30.2,23.7
  Bottom 0.305: v8.8,26.22 8.68,26.4 11.65,26.4 12.3,27 13.1,27 13.2,27.1 13.2,27.35 | 13.2,27.35 13.2,28 12.5,28.7 v11.49,28.7 | v15.55,27.3 13.25,27.3 13.2,27.35 | v38.85,21.35 38.85,21.96 | v48.25,54.7 48.9,54.7 48.95,54.65 | v13.2,44.7 13.2,49 v12.65,49.4
  Bottom 0.406: v52.6,24.95 57.6,24.95 58.35,24.65 | 58.35,19.55 v57.4,19.05 56.2,20.25 48.45,20.25 47.85,20.25 46.15,21.96 38.85,21.96 35.2,21.96 34.7,22.45 31.95,22.45 v31.05,23.55 | v11.49,28.7 11.34,28.75 v8.8,28.75 4.85,28.8 4.3,28.25 3.62,28.25 v3.1,28.77 2.77,29.1 2.35,29.1 2.1,28.85 v2.12,24.78 | v8.58,13.2 8.58,13.17 9.12,12.63
  Bottom 0.5: v57.4,19.05 56.9,19.05
  Bottom 0.61: v2.12,24.78 v2.1,21.75 2.1,19.6 2.65,19.05 3.5,19.08 | 3.5,19.08 4.1,19.1 v4.18,19.02 | v4.18,19.02 4.85,18.35 4.85,17.1 | 57.5,18.95 v57.4,19.05 | v4.18,19.02 3.56,19.02 3.5,19.08 | v31.85,41.65 33.65,41.65 v34.5,42.5 | v49.15,50.2 48.95,50.4 48.95,54.65 48.95,59.45
  Bottom 0.8: 4.85,17.1 v8.58,13.2 12.45,9.15 15.65,9.15 v18.07,6.73 19.5,5.3 56.35,5.3 57.5,6.45 v57.5,11.2 57.5,18.95 | v59.6,59.45 48.95,59.45 v36.35,59.45 23.85,59.45 20.35,55.95 20.35,54.4 20.7,54.05 22.05,54.05 C34.10
  Bottom 0.813: 58.35,24.65 58.35,19.55
+5V  (via drill 0.3, 0.5)
  Top 0.61: C1.1 60.3,13.68 60.96,14.35 60.96,17.94 v60.95,17.95
  Top 0.8: D1.C 14.4,31.8 v14.15,31.55
  Top 0.813: T1.E22 61.17,19.07 60.95,18.85 v60.95,17.95
  Bottom 0.8: v60.95,17.95 61.25,3.45 18.65,3.45 14.7,7.65 11.3,7.65 0.8,18.2 0.8,32.3 1.95,33.85 12.15,33.85 v14.15,31.55
A  (via drill 0.3)
  Top 0.406: Q6.3 51.45,50.6 v52.1,51.35 | v51,53.45 51.24,53.69 C25.P$33
  Bottom 0.406: v52.1,51.35 52.1,52.35 v51,53.45
BOOT  (via drill 0.3)
  Top 0.15: v5.65,1.75 5.65,15.4 v7.45,16.95 | v31.95,16.95 31.95,18.05 32.45,18.7 32.45,21.84 | IC3.94 33.35,27.5 33.7,27.15 33.7,25.1 | 33.7,25.1 33.7,24.85 33.4,24.5 33.4,23.5 33.02,22.98 32.75,22.5 32.45,21.84 | RN3.7 32.45,21.84 | IC3.3 35,25.1 34.95,25.15 33.75,25.15 33.7,25.1 | B2.P$2 12.7,3 v12.45,2.65
  Bottom 0.15: v7.45,16.95 v31.95,16.95 | v5.65,1.75 6.9,0.8 11.45,0.8 12.45,1.9 v12.45,2.65
CC1A  (via drill 0.3)
  Top 0.15: C10.CC1 8.85,36.85 v9.1,37.1 | v10,42.05 RN1.8
  Bottom 0.15: v9.1,37.1 10,38 v10,42.05
CC2A  (via drill 0.3)
  Top 0.15: C10.CC2 7.51,33.9 9.05,33.9 v9.55,34.8 | v10.9,41.55 10.9,40.47 RN1.7
  Bottom 0.15: v9.55,34.8 9.55,36.6 10.5,37.85 10.5,41.15 v10.9,41.55
CLK  (via drill 0.3)
  Top 0.15: v51.45,29.1 53.25,29.1 55.35,31.15 R2.2 | v38,34.9 IC3.67
  Bottom 0.15: v51.45,29.1 51,30.15 43.55,30.15 v38,34.9
D0  (via drill 0.3)
  Top 0.15: C25.P$17 59.25,57.11 58.05,58.3 41.7,58.3 v41.1,57.8 | IC3.61 41,54.8 41.1,54.95 v41.1,55.7
  Bottom 0.15: v41.1,55.7 v41.1,57.8
D1
  Top 0.15: C25.P$18 58.75,56.95 57.85,57.85 42.35,57.85 40.35,56 40.35,55.4 40.5,55.05 IC3.62
D2  (via drill 0.3)
  Top 0.15: C25.P$19 58.25,56.86 57.6,57.45 42.9,57.45 41.7,56.2 v41.7,45.8 | IC3.81 33.25,34 33.65,34.35 33.65,36.3 32.65,37.2 31.1,37.2 30.65,37.75 30.65,42.65 v33.8,45.8
  Bottom 0.15: v41.7,45.8 v33.8,45.8
D3  (via drill 0.3)
  Top 0.15: C25.P$20 57.75,56.75 57.45,57.1 43.45,57.1 42.35,56 v42.35,45.15 | IC3.82 32.31,33.45 33.3,33.45 34.05,34.1 34.05,36.4 32.85,37.5 31.4,37.5 31.05,37.85 31.05,41.7 v34.5,45.1
  Bottom 0.15: v42.35,45.15 v34.5,45.1
D4
  Top 0.15: C25.P$21 57.25,36.3 51.45,30 IC3.37
D5
  Top 0.15: C25.P$22 56.75,36.49 51.25,30.5 IC3.38
D6
  Top 0.15: C25.P$23 56.25,36.9 50.85,31 IC3.39
D7
  Top 0.15: C25.P$24 55.75,36.99 50.75,31.5 IC3.40
D8
  Top 0.15: C25.P$25 55.25,37.09 50.65,32 IC3.41
D9
  Top 0.15: C25.P$26 54.75,37.15 50.6,32.5 IC3.42
D10
  Top 0.15: C25.P$27 54.25,37.2 50.55,33 IC3.43
D11
  Top 0.15: C25.P$28 53.74,37.24 50.5,33.5 IC3.44
D12
  Top 0.15: C25.P$29 53.24,37.34 50.4,34 IC3.45
D13
  Top 0.15: C25.P$30 52.74,53 50.8,50.85 45.1,50.85 44.05,49.35 44.05,38.29 IC3.55
D14
  Top 0.15: C25.P$31 52.24,53.14 50.5,51.2 44.85,51.2 43.5,49.35 IC3.56
D15
  Top 0.15: C25.P$32 51.74,53.25 50.2,51.55 44.6,51.55 43,49.45 IC3.57
DONE  (via drill 0.3)
  Top 0.15: T1.E8 v64.6,36.85 | v37,24.4 IC3.7
  Bottom 0.15: v64.6,36.85 63.95,36.85 62.4,35.3 59.5,35.3 52.1,27.7 47.3,27.7 46.8,27.2 46.8,26.1 45.2,24.5 37.1,24.5 v37,24.4
DQ0  (via drill 0.3)
  Top 0.127: T1.W41 15.35,26.69 15.1,26.9 14.5,26.9 14.29,26.69 12.52,26.69 IC5.D3 11.99,27.26 v11.5,27.7 | IC4.D3 4.07,26.75 v4.1,26.75
  Bottom 0.127: v4.1,26.75 5.15,27.75 v11.5,27.7
DQ1  (via drill 0.3)
  Top 0.127: T1.W16 19.06,26.69 18.45,27.3 16.3,27.3 15.85,27.9 15.15,27.9 15.05,27.7 13.56,27.7 IC5.D2 v12.5,27.71 v12.5,27.7 | IC4.D2 5.07,26.8 v5.09,26.8
  Bottom 0.127: v5.09,26.8 8.5,26.75 8.75,26.95 9.55,26.95 9.75,26.75 11.5,26.75 v12.5,27.7
DQ2  (via drill 0.3)
  Top 0.127: T1.W19 19.38,22.88 18.7,22.2 13.15,22.2 11.5,23.85 v11.5,25.71 IC5.C4 | IC4.C4 v3.1,25.77
  Bottom 0.127: v3.1,25.77 3.62,25.25 3.65,25.25 3.8,25.15 10.95,25.1 11.45,25.65 v11.5,25.71
DQ3
  Top 0.127: T1.W38 12.35,30.5 10.5,28.65 10.5,27.7 | IC4.D4 2.62,27.27 3.1,27.75 10.5,27.7 | 10.5,27.7 10.65,27.7 10.99,27.36 IC5.D4
DQ4  (via drill 0.3)
  Top 0.127: T1.W42 v15.57,25.42 | v9.85,23.1 9.4,23.7 9.4,26.38 IC5.D5 | v7,23.1 7,22.3 2.85,22.3 1.15,23.5 1.15,26.85 1.6,27.2 IC4.D5
  Bottom 0.127: v15.57,25.42 13.8,23.65 11.45,23.65 10.9,23.1 v9.85,23.1 v7,23.1
DQ5  (via drill 0.3)
  Top 0.127: T1.W17 22.27,25.42 22.7,25.85 22.7,28.15 22.3,28.55 19.6,28.55 18.5,29.85 12.9,29.85 v12.25,29.5 12.29,28.89 IC5.E3 | IC4.E3 4.03,28.85 v4.05,29.05
  Bottom 0.127: v4.05,29.05 4.4,29.25 7.55,29.25 7.8,29.5 v12.25,29.5
DQ6  (via drill 0.3)
  Top 0.127: T1.W39 v13.3,29.23 IC5.E2 | IC4.E2 5,28.72 v5,30.2
  Bottom 0.127: v5,30.2 5.2,30.2 5.65,29.6 7.05,29.6 7.5,30.15 12.93,30.15 v13.3,29.23
DQ7  (via drill 0.3)
  Top 0.127: T1.W15 19.14,27.96 18.5,28.6 14.7,28.6 v14.65,28.65 14.38,28.42 IC5.E1 | v6.2,30.2 5.58,29.77 IC4.E1
  Bottom 0.127: 14.55,29.5 14.54,29.56 | 14.54,29.56 13.1,30.5 6.6,30.5 v6.2,30.2 | v14.65,28.65 14.54,28.76 14.54,29.56
DQK  (via drill 0.3)
  Top 0.127: T1.W18 19.25,24.15 18.65,24.75 15.25,24.75 15.15,24.7 v13.51,24.7 IC5.B2 | IC4.B2 5.25,24.72 v5.45,24.5
  Bottom 0.127: v5.45,24.5 5.55,24.5 5.8,24.75 11.5,24.7 12.15,24.05 13.35,24 13.45,24.1 13.45,24.74 v13.51,24.7
DQR  (via drill 0.3)
  Top 0.127: T1.W40 18.39,27.96 19.05,27.3 22.05,27.3 22.35,27 22.35,26.2 22.2,26.05 15.4,26.05 15,25.7 12.51,25.7 IC5.C3 11.46,26.75 10.75,26.75 10.5,26.45 v10.49,25.74 | v4.1,25.77 IC4.C3
  Bottom 0.127: v10.49,25.74 10.37,25.57 4.3,25.62 4.23,25.77 v4.1,25.77
DRS  (via drill 0.3)
  Top 0.15: v42.1,32.25 35.95,25.85 IC3.5 | v62.4,51.35 62.75,52.25 62.75,55.75 C25.P$10
  Bottom 0.15: v42.1,32.25 42.05,32.95 42.6,33.6 48.2,39.6 56.9,39.6 62.65,44.95 62.65,50.7 62.4,50.95 v62.4,51.35
DS0  (via drill 0.3)
  Top 0.127: T1.W43 v15.55,24.15 | IC4.C2 5.1,25.75 6.1,25.75 v6.1,22.9
  Bottom 0.127: v15.55,24.15 14.05,23.3 11.6,23.3 10.7,22.45 6.65,22.5 6.6,22.6 6.45,22.6 v6.1,22.9
DS1
  Top 0.127: T1.W44 13.33,22.88 IC5.A3
FCK
  Top 0.15: T1.E13 61.4,30.5 60.75,31.15 R2.1
FM  (via drill 0.3)
  Top 0.15: IC3.93 36.6,27.95 v41.45,32.9 | v62.05,50.45 62.5,50.35 63.95,50.35 64.15,50.55 64.15,51.4 63.75,51.81 C25.P$8
  Bottom 0.15: v41.45,32.9 47.95,39.95 56.55,39.95 62.35,45.1 62.35,49.9 62.05,50.25 v62.05,50.45
FS+  (via drill 0.3)
  Top 0.15: IC3.71 36,39.1 36.2,39.3 36.2,42.55 v35.65,43 | v10.75,34.9 10.52,34.9 10.02,35.45 9.2,35.45 8.7,34.85 C10.DP2 6.33,34.85 6.15,35.05 6.15,35.7 6.3,35.85 C10.DP1
  Top 0.2: IC1.6 11.02,34.83 v10.75,34.9
  Bottom 0.15: v35.65,43 35.4,43.2 35.2,43.4 12.7,43.4 11.5,35.8 10.75,35.05 v10.75,34.9
FS-  (via drill 0.3)
  Top 0.15: IC3.70 36.5,43.4 v36.15,43.85 | v10.55,36.55 10.27,36.35 8.8,36.35 | 8.8,36.35 C10.DN2 | C10.DN1 8.62,35.35 8.8,35.55 8.8,36.35
  Top 0.2: IC1.4 10.83,36.73 v10.55,36.55
  Bottom 0.15: v36.15,43.85 12.25,43.95 10.9,36.65 10.8,36.55 v10.55,36.55
GND  (via drill 0.3)
  Top 0.15: 38.4,21.85 38.4,21.8 38.15,21.55 38.15,21.3
  Top 0.3: IC4.B3 3.2,24.87 v3.1,24.79 | IC5.C1 14.72,26.22 v14.8,26.3 | v19.15,25.35 19.55,25.35 19.6,25.4
  Top 0.305: IC3.10 38.5,21.95 38.4,21.85
  Bottom 0.3: v3.1,24.79 3.05,24.8 | v14.8,26.3 18.2,26.3 v19.15,25.35
  other vias: 11.3,31.65 9.1,38.8 8.6,39.9 37.5,1 42.4,0.95 36.4,1 43.45,0.95 68.6,22 69.5,21.45 0.95,40.75 9.15,32.3 43.85,56 44.7,56 45.6,56 45.45,46.25 37.5,58.1 16.5,57.5 45.45,45.35 51.85,45.35 73.7,55.5 43.45,32.05 41.75,27.77 28.95,41.67 39.75,48.95 34.1,33.1 35.3,32.3 34,49.9 30.45,49.9 1.85,30.1 43.8,31.2 45.8,32.8 45.8,31.6 39.2,27.77 39.2,25.87 41.7,25.77 43.75,25.72 37.7,25.82 57.45,27.52 55,27.57 60.95,28.92 57.4,29.77 60.6,33.67 60.6,32.37 61.4,36.67 61.45,39.42 61.4,41.92 58.6,54.37 60.6,54.37 58.6,50.32 59.95,50.32 52,42.62 52.05,37.37 67.3,32.17 69.85,30.57 67.3,43.52 66.45,51.82 73.75,51.77 74.05,41.87 74.2,32.22 74.25,24.87 73.9,15.77 74.05,7.87 54.2,16.17 41.7,14.77 42.85,14.77 1.45,45.95 1.55,54.1 12.65,52.3 14.45,45.65 9.9,45.25 23.3,44.7 30.4,47.3 34.25,53.65 34.25,55.45 39.45,54.85 37.5,54.85 35.15,58.1 20,57.55 16.25,52.25 30.8,55.5 30.8,53.7 68.45,53.42 67.05,40.37 68.1,36.67 69.8,25.82 26.65,48.1 33,42.62 39.8,44.35 39.75,40.3 39.75,42.3 39.75,46.6 30.35,44.95 24.65,58.45 23.35,28.65 23.4,25.85 23.2,22.6 23.35,14.65 20.95,14.05 17.15,14 15.35,20.6 18.75,23.5 11.3,19.2 4.3,12.45 9.05,16.1 4.15,7.35 8.1,7.3 21.15,1.85 28,1.8 53.1,1.95 60.35,1.85 67.3,1.85 76,1.85 59.7,58.1 69.8,15.82 69.7,49.07 51.3,17.77 48.25,17.77 29.25,15.97 22.7,8.77 19.2,8.72 27.95,32.75 23.1,37.6 23,42.1 19,42.1 19.05,45.7 13.6,40.15 13.45,38.05 7.9,23.75 5.25,23.55 3.1,26.75 6.85,24.1 12.48,24.73
  pour Top (rank 2): 0,1.45 0,59.44 arc-90 1.56,61 78.58,61 arc-90 80,59.58 80,1.43 arc-90 78.57,0 1.45,0 arc-90
  pour Bottom (rank 2): 0,1.41 0,59.44 arc-90 1.56,61 78.58,61 arc-90 80,59.58 80,1.44 arc-90 78.56,0 1.41,0 arc-90
GP1  (via drill 0.3)
  Top 0.15: T1.W31 18.96,39.39 19.15,39.2 19.15,36 19.7,34.95 22.6,34.95 v26.05,31.9 | v31.1,31.7 31.1,31.15 31.25,31 IC3.87
  Bottom 0.15: v26.05,31.9 30.9,31.9 v31.1,31.7
GP2  (via drill 0.3)
  Top 0.15: v22.6,21.5 22.24,21.61 T1.W20 | IC3.2 34.5,21.75 v34.6,21.5
  Bottom 0.15: v34.6,21.5 32.3,21.5 32.15,21.65 31.5,21.65 31.35,21.5 v22.6,21.5
GP3  (via drill 0.3)
  Top 0.15: T1.E31 60.39,39.39 v60.5,39.4 | v43.85,33.1 39.5,36.35 IC3.64
  Bottom 0.15: v60.5,39.4 58.15,39.4 57.55,38.85 48.65,38.85 44.45,34.45 43.7,33.7 v43.85,33.1
GP4
  Top 0.15: IC3.63 40,36.65 44.65,33.3 44.65,29.15 45,28.65 45.4,28.65 46.75,27.3 46.75,24.15 47.35,23.5 47.85,22.95 48.1,22.7 55.3,22.7 55.75,22.2 60.65,22.25 61.29,21.61 T1.E20
K1
  Top 0.15: RN8.5 48.48,52.22 50.75,54.5 C25.P$34
K2
  Top 0.15: RN8.6 48.5,53.1 50.25,54.85 C25.P$35
K3
  Top 0.15: RN8.7 48.8,53.9 49.75,54.85 C25.P$36
MODE  (via drill 0.3)
  Top 0.15: IC3.4 35.5,21.45 33.15,19.3 33.15,18.9 32.8,18.55 v32.8,17.6 | v6.35,17.6 5.3,16.7 5.3,2.65 5.1,2.45 RN6.7
  Bottom 0.15: v32.8,17.6 v6.35,17.6
MX1  (via drill 0.3)
  Top 0.15: v24.8,36.35 23.8,37.25 23.8,40.65 23.15,40.95 22.35,40.65 T1.W5 | v49.45,25.4 48.75,25.5 IC3.28
  Bottom 0.15: v24.8,36.35 24.8,36.25 31.7,36.25 36.3,32.5 36.3,24.25 36.6,23.8 45.75,23.8 45.75,24.45 46.8,25.5 48.75,25.5 v49.45,25.4
MX2  (via drill 0.3)
  Top 0.15: IC3.25 46,25.35 46.1,25.65 46.1,26.15 v45.6,26.85 | v23.1,38.85 22.61,39.39 T1.W6
  Bottom 0.15: v45.6,26.85 31.1,38.85 v23.1,38.85
MX3  (via drill 0.3)
  Top 0.15: IC3.24 v45.5,25.95 | v18.95,40 18.55,40.6 18.5,40.65 17.18,40.65 T1.W30
  Bottom 0.15: v45.5,25.95 45.5,25.9 31.05,38.2 20.2,38.2 v18.95,40
MX4  (via drill 0.3)
  Top 0.15: T1.W21 22.49,20.34 v22.6,20.4 | v40.95,20.3 40.95,20.55 41.35,21.05 41.35,21.45 41.05,21.75 41.05,22.71 IC3.15
  Bottom 0.15: v22.6,20.4 31.3,20.4 31.45,20.25 32.1,20.25 32.25,20.3 v40.95,20.3
MX5  (via drill 0.3)
  Top 0.15: T1.W46 18.21,20.34 18.3,20.25 v18.85,19.65 | v41.85,20.4 41.85,21.5 41.5,21.8 IC3.16
  Bottom 0.15: v18.85,19.65 41.3,19.7 v41.85,20.4
MX6  (via drill 0.3)
  Top 0.15: T1.W45 19.09,21.61 19.7,21.1 19.7,19.7 v19.3,18.85 | v42.45,21.15 42.45,21.4 42.05,21.8 42.05,22.71 IC3.17
  Bottom 0.15: v19.3,18.85 35.45,18.85 35.95,19.3 42.05,19.3 42.45,20.1 v42.45,21.15
MX7
  Top 0.15: T1.E5 62.25,40.65 61.55,41.3 58.05,41.3 57.7,41.1 57.7,35.9 52.45,30.1 52.05,29.7 51.15,29.7 50.85,29.4 50.85,28.25 50.6,28 IC3.33
MX8  (via drill 0.3)
  Top 0.15: T1.E6 v64.39,39.39 v64.4,39.4 | v49.9,28.65 49.85,28.65 49.7,28.5 IC3.34
  Bottom 0.15: v64.4,39.4 64.4,37.75 62.3,35.65 59.2,35.65 51.9,28.1 50.25,28.1 v49.9,28.65
MX9  (via drill 0.3)
  Top 0.15: T1.E30 60.39,40.66 v61.35,40.65 | v49.3,29.4 49.2,29.4 48.75,29 IC3.35
  Bottom 0.15: v49.3,29.4 50.15,29.4 50.95,28.45 51.7,28.45 59.05,36 62.05,36 63.4,37.4 63.4,39.6 v61.35,40.65
MX10
  Top 0.15: IC3.23 45,21.9 45.25,21.65 54.75,21.65 55.4,21 60.5,21 61.25,20.25 62.8,20.25 T1.E21
MX11
  Top 0.15: IC3.22 44.5,21.9 45.15,21.25 54.5,21.25 55.4,20.35 59.06,20.35 T1.E46
MX12
  Top 0.15: IC3.18 42.55,22.71 42.55,26.75 43.35,27.55 45.8,27.55 46.45,26.9 46.45,23.8 47.9,22.35 55.05,22.35 55.8,21.6 59.06,21.6 T1.E45
MX13  (via drill 0.3)
  Top 0.15: IC3.29 50,26 v50.4,25.6 | C41.P$1 13.65,19.3 13.25,18.85 11.5,16.95 8.4,16.9 6.6,15.45 v6.3,14.15
  Bottom 0.15: v50.4,25.6 58.4,25.6 59.05,24.9 59.1,18.8 58.65,17.8 58.65,6.2 56.75,4.3 19.15,4.3 15.15,8.3 12.1,8.3 v6.3,14.15
MX14  (via drill 0.3)
  Top 0.15: IC3.30 50.7,26.5 v50.85,26.4 | v64.05,6.25 C36.P$1
  Bottom 0.15: v50.85,26.4 51.2,26.1 58.65,26.1 59.65,24.95 59.65,23.9 63.9,20.85 63.9,13.8 63.2,13.1 63.2,7.1 v64.05,6.25
MX15  (via drill 0.3)
  Top 0.15: IC3.31 51.5,27 v51.6,26.9 | v68.75,23.25 C38.P$1
  Bottom 0.15: v51.6,26.9 51.9,26.7 58.95,26.7 60.05,27.8 66.95,27.8 68.3,26.45 68.3,23.7 v68.75,23.25
MX16  (via drill 0.3)
  Top 0.15: IC3.32 52.45,27.5 v52.65,27.3 | v65.1,38.7 65.1,39.8 C35.P$1
  Bottom 0.15: v52.65,27.3 59.7,34.65 63.95,34.65 65.2,35.9 65.2,38.6 v65.1,38.7
N$2
  Top 0.15: RN6.3 1.45,1.65 L1.G
N$4
  Top 0.15: RN6.2 1.95,2.45 L1.R
N$6
  Top 0.15: RN6.4 1.38,0.77 0.48,1.6 0.48,2.55 L1.B
N$10
  Top 0.15: IC3.13 40,18.12 41.09,17.03 X2.3 42.38,16.37 C6.2
N$11
  Top 0.15: IC3.12 39.5,19.49 X2.1 38.98,18.37 40,17.35 40,15.17 C5.2
N$12
  Top 0.15: IC3.9 38,21.84 37.8,21.64 37.8,17.85 X1.P$1 35.14,14.72 C4.2
N$13
  Top 0.15: IC3.8 37.5,17.84 37.2,17.49 37.2,17.5 X1.P$2 35.15,17.22 C3.2
N$14
  Top 0.3: IC3.73 35,40.26 C19.1
N$87
  Top 0.3: IC3.48 49.45,35.5 C17.2
N$88
  Top 0.2: IC3.21 IC3.20
  Top 0.3: IC3.21 44,21.6 44.8,20.8 44.8,20.27 C9.1 44.86,20.26 R1.1
P0
  Top 0.15: T1.E33 60.7,36.85 61.3,37.45 64.8,37.45 65.4,38.05 67.6,38.05 67.85,38.3 67.85,40.65 67.15,41.35 C35.P$2
P1
  Top 0.15: T1.E9 64.43,35.58 65.25,36.4 65.25,37.25 65.65,37.7 67.75,37.7 68.3,38.2 68.3,41.5 67.4,42.4 65.6,42.4 C35.P$3
P2
  Top 0.15: T1.E34 61.12,35.58 61.75,34.95 68.05,34.95 68.8,35.8 68.8,43.15 67.3,44.65 C35.P$5
P3
  Top 0.15: T1.E10 68.11,34.31 69.3,35.5 69.3,44.75 67.2,46.85 C35.P$7
P4
  Top 0.15: T1.E35 61.04,34.31 61.65,33.7 68.3,33.7 69.85,35.25 69.85,45.35 67.25,47.95 C35.P$8
P5
  Top 0.15: T1.E11 68.34,33.04 70.3,35 70.3,46 67.25,49.05 C35.P$9
P6
  Top 0.15: T1.E36 61.06,33.04 61.7,32.4 65.2,32.4 C38.P$9
P7
  Top 0.15: T1.E12 63.83,31.77 64.35,31.25 65.25,31.25 C38.P$8
P8
  Top 0.15: T1.E37 61.08,31.77 61.65,31.2 63.95,31.2 64.35,30.8 64.35,30.5 64.95,29.9 65.5,29.9 C38.P$7
P9
  Top 0.15: T1.E14 64.12,29.23 64.3,29.05 64.3,28.35 64.9,27.75 65.45,27.75 C38.P$5 65.5,27.7
P10
  Top 0.15: T1.E15 64.09,27.96 64.4,27.65 64.4,25.65 64.55,25.5 65.5,25.5 C38.P$3
P11
  Top 0.15: C38.P$2 64.5,24.35 64.1,24.75 64.1,27.1 63.85,27.35 61.8,27.35 61.19,27.96 T1.E40
P12  (via drill 0.3)
  Top 0.15: T1.E16 61.59,26.69 v61.35,26.5 | v67,15.05 C36.P$9
  Bottom 0.15: v61.35,26.5 65.25,26.5 67.15,24.55 67.15,15.2 v67,15.05
P13  (via drill 0.3)
  Top 0.15: T1.E41 60.19,26.69 v60.65,27.15 | v67.8,13.95 C36.P$8
  Bottom 0.15: v60.65,27.15 66.2,27.15 67.8,25.55 v67.8,13.95
P14  (via drill 0.3)
  Top 0.15: T1.E17 61.42,25.42 v61.25,25.25 | v66.95,12.85 C36.P$7
  Bottom 0.15: v61.25,25.25 63.75,25.25 65.55,23.45 C36.P$7 v66.95,12.85
P15  (via drill 0.3)
  Top 0.15: T1.E42 60.17,25.42 v60.65,25.9 | v67.3,10.65 C36.P$5
  Bottom 0.15: v60.65,25.9 64.95,25.9 66.3,24.55 66.3,13.9 66.6,13.5 67.25,13.5 67.8,12.85 67.8,12.55 67.3,12.05 v67.3,10.65
P16  (via drill 0.3)
  Top 0.15: T1.E18 61.75,24.15 v61.45,23.85 | v64.1,8.45 C36.P$3
  Bottom 0.15: v61.45,23.85 63.2,23.85 64.45,22.6 64.45,8.8 v64.1,8.45
P17  (via drill 0.3)
  Top 0.15: T1.E43 60.45,24.15 v60.7,24.45 | v67.25,7.35 C36.P$2
  Bottom 0.15: v60.7,24.45 63.6,24.45 64.95,22.95 64.95,9.65 v67.25,7.35
P18
  Top 0.15: T1.W10 22.49,34.31 26.55,30.45 26.55,14.15 23.4,10.5 C41.P$9
P19
  Top 0.15: T1.W35 18.54,34.31 19.15,33.7 22.45,33.7 26.15,30 26.15,14.65 23.4,11.6 C41.P$8
P20
  Top 0.15: T1.W11 22.36,33.04 25.7,29.8 25.7,15.1 23.35,12.7 C41.P$7
P21
  Top 0.15: T1.W36 19.21,33.04 19.8,32.45 22,32.45 25.3,29.55 25.3,15.45 23.1,13.25 15.95,13.25 15.35,14.6 C41.P$5
P22  (via drill 0.3)
  Top 0.15: T1.W12 21.38,31.77 24.5,29.45 24.7,29.3 v24.7,24.3 24.7,23.75 24.9,23.6 24.9,15.85 24.8,15.75 v24.25,15.35 | IC3.97 28.55,26 v27.25,26.8 | RN6.5 5.68,0.77 6.25,1.35 6.25,12.25 8.1,15.35 v12.75,15.35 13.25,17.1 C41.P$3
  Bottom 0.15: v24.25,15.35 v12.75,15.35 | v27.25,26.8 24.9,24.5 v24.7,24.3
P23  (via drill 0.3)
  Top 0.15: T1.W13 21.85,30.5 24.1,29.1 24.1,23.4 v24.3,23.2 24.3,22.55 24.45,22.3 24.5,17.25 24.25,16.95 24.05,16.7 v24.05,16.3 | IC3.98 28.65,25.5 v27.4,25.85 | v12.35,16.35 12.35,17.3 13.25,18.2 C41.P$2
  Bottom 0.15: v24.05,16.3 23.75,16.35 v12.35,16.35 | v27.4,25.85 24.9,23.2 v24.3,23.2
QCK  (via drill 0.3)
  Top 0.15: T1.W33 v15.8,36.85 | 47.69,29.55 IC3.36 47.64,29.45 v45.45,29.45
  Bottom 0.15: v15.8,36.85 15.8,40.05 16.5,40.65 20.15,40.65 21.35,39.5 31.25,39.5 43.55,29.5 43.6,29.45 v45.45,29.45
QD0  (via drill 0.3)
  Top 0.15: T1.W9 20.12,35.58 19.6,36.1 19.6,39.8 19.8,40 22.55,40 v23.1,40.15 | v42.5,36.7 IC3.58
  Bottom 0.15: v23.1,40.15 31.6,40.15 37,35.7 41.8,35.65 v42.5,36.7
QD1  (via drill 0.3)
  Top 0.15: T1.W34 16.03,35.58 v15.8,35.6 | v41.5,36.4 42,37.2 IC3.59
  Bottom 0.15: v15.8,35.6 15.65,35.65 15,36.35 15,40.4 15.6,41.1 23.45,41.1 23.85,40.65 31.65,40.65 36.9,36.4 v41.5,36.4
QD2  (via drill 0.3)
  Top 0.15: T1.W37 v18.63,31.77 | v34,24.15 IC3.1
  Bottom 0.15: v18.63,31.77 19.5,31.3 30.65,31.3 34,27.5 v34,24.15
QD3  (via drill 0.3)
  Top 0.15: T1.W14 19.72,29.23 19.65,29.3 18.15,31.15 15.95,31.15 v15.6,31.55 | v40.9,37.05 41.25,37.05 41.5,37.3 IC3.60
  Bottom 0.15: v15.6,31.55 15.6,33.65 14.4,34.4 14.4,40.5 15.3,41.5 23.9,41.5 24.35,41.05 32,41.05 37.1,36.9 40.75,36.9 v40.9,37.05
RX  (via drill 0.3)
  Top 0.15: IC3.68 37.5,52 v38.15,52.6 | C10.SBU2 v6,37.35
  Bottom 0.15: 37.5,52 v38.15,52.6 37.6,52.05 20.3,52.05 17,55.35 12.05,55.35 5.3,48.5 5.3,37.75 5.7,37.35 v6,37.35
SCD  (via drill 0.3)
  Top 0.15: IC3.83 30.7,33 25.45,38.4 25.45,44.05 v24.9,44.6 | v20.8,48.55 16.7,48.55 16.25,49 C16.P$7 13.6,49 12.3,47.7 12.3,41.2 12.55,40.95 RN1.5
  Bottom 0.15: v24.9,44.6 24.9,45.1 v20.8,48.55
SCK
  Top 0.15: IC3.52 45.5,40.35 46.65,41.5 IC6.6
SCL  (via drill 0.3)
  Top 0.15: T1.E32 60.12,38.12 v60.5,38.15 | v46.25,34.5 IC3.46
  Bottom 0.15: v60.5,38.15 49.4,38.15 v46.25,34.5
SCL2  (via drill 0.3)
  Top 0.15: T1.E44 58.55,22.88 | 58.55,22.88 57.58,22.88 57.4,23 v56.15,23 | v30.25,27.35 30.6,27 IC3.95 | 58.57,22.9 58.55,22.88
  Bottom 0.15: v56.15,23 55.75,22.7 35.7,22.75 35.05,23.2 32.45,23.2 30.3,26.35 v30.25,27.35
SD0  (via drill 0.3)
  Top 0.15: IC3.65 v39,50.15 | C16.P$3 v16.4,53.4 18.15,53.4 19.86,51.69 RN5.4
  Bottom 0.15: v39,50.15 38.35,50.8 19,50.8 v16.4,53.4
SD1  (via drill 0.3)
  Top 0.15: IC3.66 38.5,49.65 38.1,50.2 v38.1,51.6 | C16.P$2 v16.65,54.5 18.1,54.5 20.74,51.86 RN5.3
  Bottom 0.15: v38.1,51.6 19.55,51.6 v16.65,54.5
SD2  (via drill 0.3)
  Top 0.15: IC3.78 30.4,35.5 27.05,38.85 v27.05,44.7 | C16.P$9 15.65,46.8 16.35,47.5 24.55,47.5 v25.2,46.85 | RN5.1 23.05,51.1 v24.2,49.95
  Bottom 0.15: v27.05,44.7 27.05,45 v25.2,46.85 24.2,47.85 v24.2,49.95
SD3  (via drill 0.3)
  Top 0.15: IC3.79 30.25,35 26.4,38.75 26.4,46.85 25.35,47.9 | C16.P$8 25.35,47.9 | RN5.2 21.54,51.79 21.8,52 23.45,52 v25.2,50.2 | v25.2,47.95 25.35,47.9
  Bottom 0.15: v25.2,50.2 v25.2,47.95
SDA  (via drill 0.3)
  Top 0.15: IC3.47 46.75,35 v46.3,35.5 | T1.E7 61.47,38.12 v61.45,38.15
  Bottom 0.15: v61.45,38.15 61.45,38.3 60.95,38.75 58.05,38.75 57.8,38.5 49.1,38.45 v46.3,35.5
SDA2  (via drill 0.3)
  Top 0.15: v56.9,23.85 57.3,23.55 60.8,23.55 61.68,22.88 T1.E19 62.91,22.9 | v29.55,26.75 29.75,26.5 IC3.96
  Bottom 0.15: v56.9,23.85 56.8,22.35 35.65,22.45 34.9,22.9 32.25,22.9 29.9,26.25 v29.55,26.75
SDK  (via drill 0.3)
  Top 0.15: IC3.80 29.95,34.5 25.95,38.6 25.95,44.55 25.7,44.7 v25.65,45.2 | v16.15,51.15 14.92,51.15 C16.P$5 13.35,51.2 11.68,49.53 RN1.6
  Bottom 0.15: v25.65,45.2 21.2,49.2 19.2,49.2 v16.15,51.15
SHA  (3 unrouted)
  Top 0.15: 2.77,30.93 C10.P$4
  Top 0.305: C11.2 6.82,31.2 C10.P$2
SI
  Top 0.15: IC3.54 44.5,40.6 45.4,41.5 45.4,42.98 IC6.5
SO
  Top 0.15: IC3.53 45,40.6 46,41.6 46,44.6 47.95,46.55 47.95,48.17 IC6.2
SWCLK
  Top 0.15: IC3.76 31.3,36.5 30.25,37.55 30.25,43.3 35.15,48.2 35.15,55.8 33.85,57.3 23.95,57.3 23.4,56.75 23.35,55.65 C34.2
SWDIO
  Top 0.15: IC3.72 35.5,39.4 35.75,39.65 35.75,41.25 33.75,41.85 33.75,43.35 35.55,45.25 35.55,56 34.05,57.75 23.2,57.75 22.1,56.75 C34.1
SWO  (via drill 0.3)
  Top 0.15: IC3.89 29.85,30 29.4,32.5 26.2,35.7 26.2,37.05 24.8,38.35 v24.8,42.05 | v29.3,42.6 29.3,55.8 28.95,56.35 28.6,56.85 25.05,56.85 24.65,56.4 C34.3
  Bottom 0.15: v24.8,42.05 28.35,42.05 v29.3,42.6
TDI  (via drill 0.3)
  Top 0.15: IC3.77 30.55,36 30,36.7 v30,36.85 | v25.15,37.2 24.2,38.1 24.2,41.7 23.85,42.05 23.85,42.7 v24.05,42.8 | v28.35,42.8 28.35,52.65 28.8,53.2 28.8,55.7 28.15,56.5 26.68,56.5 C34.4
  Bottom 0.15: v30,36.85 25.85,36.85 v25.15,37.2 | v24.05,42.8 v28.35,42.8
TX  (via drill 0.3)
  Top 0.15: IC3.69 37,52.6 v37.2,53.15 | C10.SBU1 5.55,34.35 v4.8,35.1
  Bottom 0.15: v4.8,35.1 4.8,48.85 11.8,55.85 17.45,55.85 20.65,52.65 36.7,52.65 v37.2,53.15
VB1+
  pour Top: 58.2,46.05 59.95,46.05 59.95,42.9 58.15,42.9
VB2+
  pour Top: 16.35,45.95 17.95,45.95 17.95,41.75 16.4,41.75
VB3+
  pour Top: 63.7,15.05 62.1,15.05 62.1,18.05 63.65,18.05
VB4+
  pour Top: 21.75,15.05 20.15,15.05 20.2,19.25 21.75,19.25
VBAT  (via drill 0.3)
  Top 0.3: IC3.6 36.5,20.13 C12.1 36.4,19.88 v36.4,18.2
  Bottom 0.3: 27.6,14.5 35.55,14.5 36.4,16.55 v36.4,18.2
  Bottom 0.305: BT1.1 27.5,14.35 27.6,14.5
VBUSA
  Top 0.3: IC1.5 13.17,35.78 | 13.17,35.78 13.25,35.7 13.25,34.2 12,32.95 D1.A | C10.VBUS@1 12.28,38.02 13.2,37.1 13.2,35.81 13.17,35.78
  Top 0.5: C10.VBUS@2 10.59,33.22 D1.A

### Text on the board
tPlace: BlackIce | Copyright Alan Wood 2021 | @folknology www.mystorm.dev | Mode
tStop: Nxt